# Altium schematic sheet GridSeed_Rev04.SchDoc (part 2 of 2)
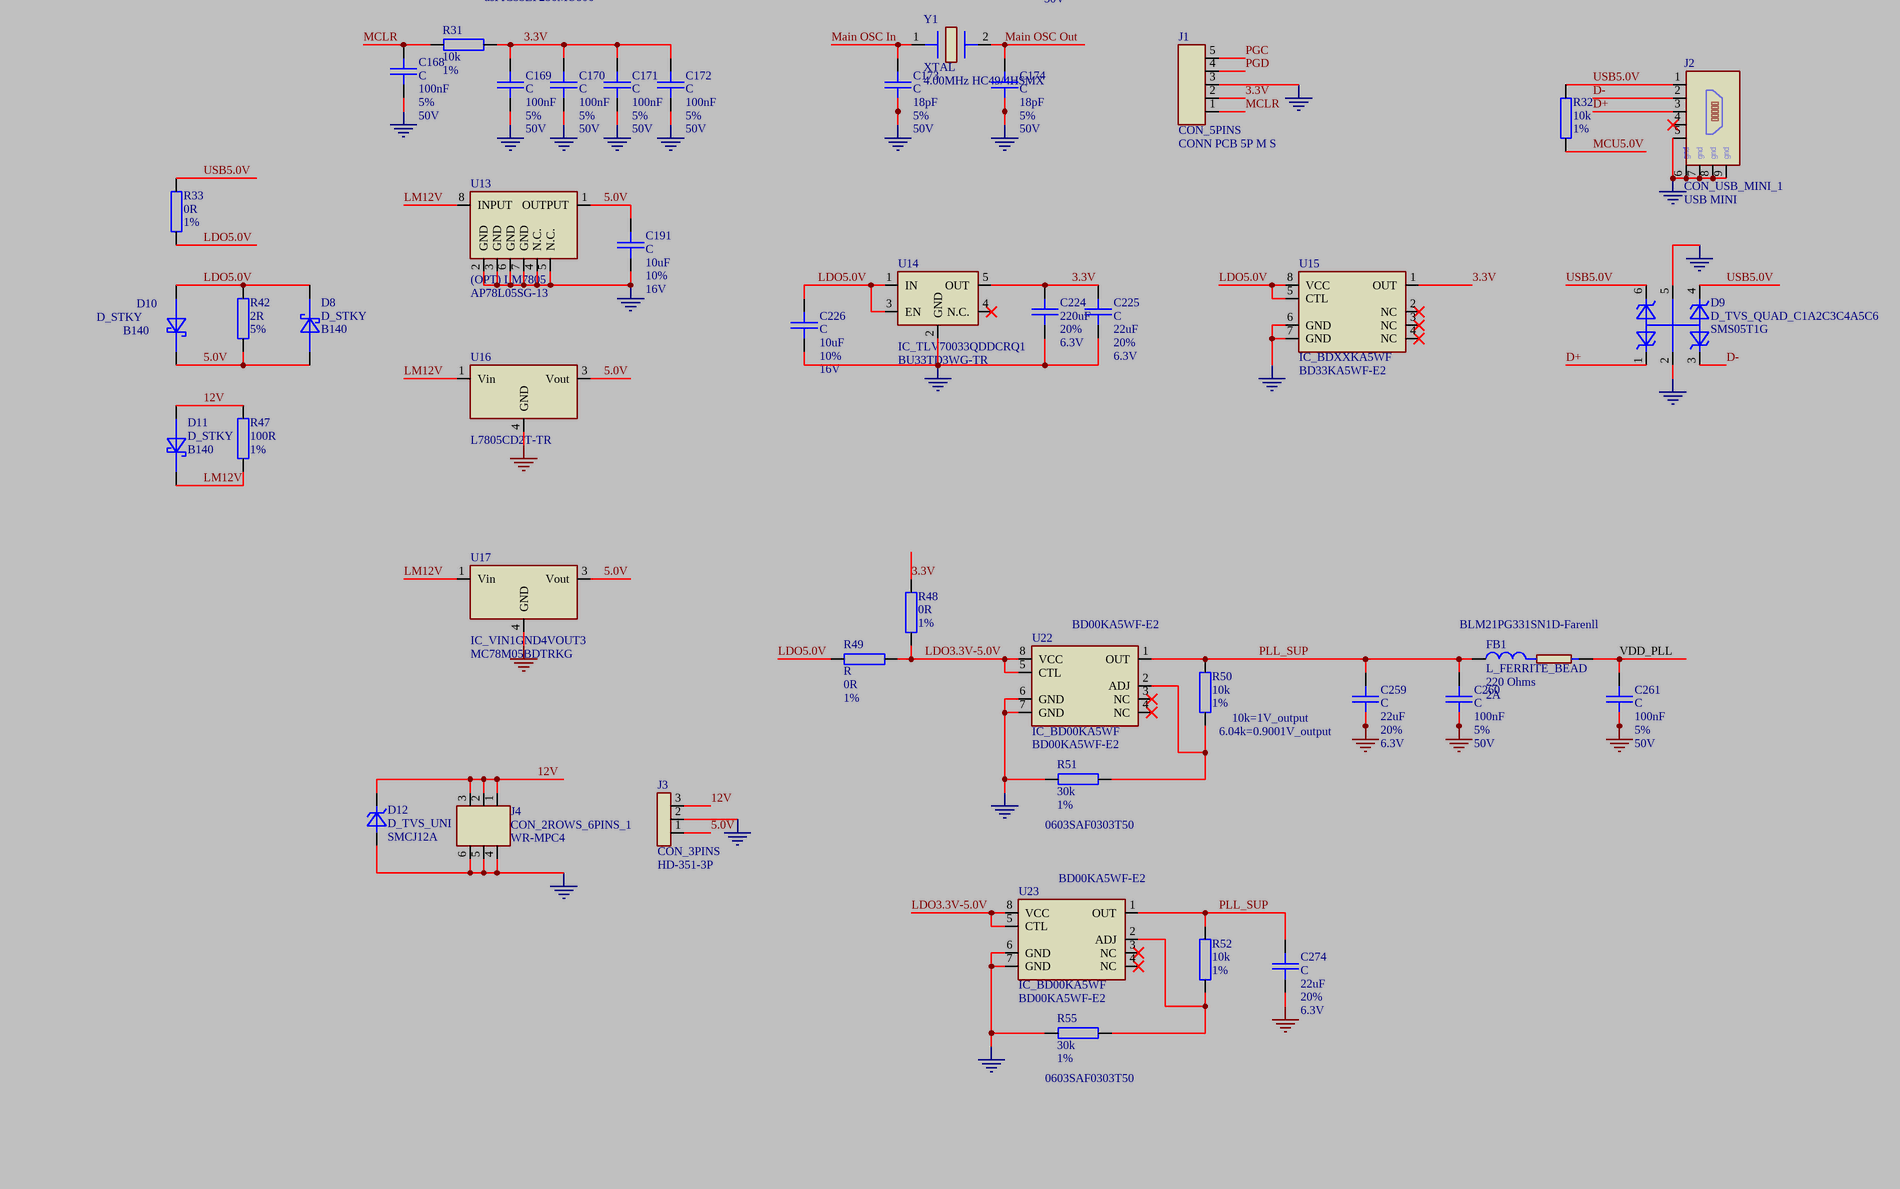
[diagram p6: GridSeed_Rev04.SchDoc, bottom right]

## Nets
GND: C1.1 C2.1 C3.1 C4.2 C5.2 C6.2 C10.1 C11.1 C12.1 C13.1 C14.1 C15.1 C16.1 C17.1 C18.1 C19.1 C20.2 C21.2 C22.1 C23.1 C24.1 C25.1 C26.1 C27.1 C28.1 C29.1 C30.1 C31.1 C32.1 C33.1 C34.1 C35.1 C36.1 C37.1 C38.1 C39.1 C40.1 C41.1 C42.1 C43.1 C44.1 C45.1 C46.1 C47.1 C48.1 C49.1 C50.1 C51.1 C52.1 C53.1 C54.1 C55.1 C56.1 C57.1 C58.1 C59.1 C60.1 C61.1 C62.1 C63.1 C64.1 C65.1 C66.1 C67.1 C68.1 C69.2 C70.1 C71.1 C72.1 C73.1 C74.1 C75.1 C76.1 C77.1 C78.1 C79.1 C80.1 C81.1 C82.1 C83.1 C84.1 C85.1 C118.1 C119.1 C120.1 C121.1 C122.1 C123.1 C124.1 C125.1 C126.1 C127.1 C128.1 C129.1 C130.1 C131.1 C132.1 C133.1 C134.1 C135.1 C136.1 C137.1 C138.2 C139.2 C140.1 C141.1 C142.1 C143.1 C144.1 C145.1 C146.1 C147.1 C148.1 C149.1 C150.1 C151.1 C152.1 C153.1 C154.1 C155.1 C156.1 C157.1 C158.1 C159.1 C160.1 C161.1 C162.1 C163.1 C166.2 C167.2 C168.2 C169.2 C170.2 C171.2 C172.2 C173.2 C174.2 C175.1 C176.1 C177.1 C178.1 C179.1 C180.1 C181.1 C182.1 C183.1 C184.1 C185.1 C186.1 C187.1 C188.1 C189.1 C190.1 C191.2 C224.1 C225.2 C226.2 C227.1 C228.1 C229.1 C230.1 C231.1 C232.1 C233.1 C234.1 C235.1 C236.1 C237.1 C238.1 C239.1 C240.1 C241.1 C242.1 C243.1 C244.1 C245.1 C246.1 C247.1 C248.1 C249.1 C250.1 C251.1 C252.1 C253.1 C254.1 C255.1 C256.1 C257.1 C258.1 C259.2 C260.2 C261.2 C262.1 C263.1 C264.1 C265.1 C266.1 C267.1 C268.1 C269.1 C270.1 C271.1 C272.1 C273.1 C274.2 C275.2 C276.1 C277.1 C278.1 C279.1 C280.1 C281.1 C282.1 C283.1 C284.1 C285.1 C286.1 C287.1 C288.1 C289.1 C290.1 C291.1 C324.1 C325.1 C326.1 C327.1 C328.1 C329.1 C330.1 C331.1 C332.1 C333.1 C334.1 C335.1 C336.1 C337.1 C338.1 C339.1 C340.1 C341.1 C342.1 C343.1 C344.1 C345.1 C346.1 C347.1 C348.1 C349.1 C350.1 C351.1 C352.1 C353.1 C354.1 C355.1 C356.1 C357.1 C358.1 C359.1 C360.1 C361.1 C362.1 C363.1 C364.1 C365.1 C366.1 C367.1 C368.1 C369.1 C370.1 C371.1 C372.1 C373.1 C374.1 C375.1 C376.1 C377.1 C378.1 C379.1 C380.1 C381.1 C382.1 C383.1 C_1.2 C_2.2 C_3.2 C_4.2 C_5.2 C_6.2 C_8.2 C_9.2 C_10.2 C_11.2 C_12.2 C_13.2 C_14.2 C_15.2 C_16.2 C_17.2 C_18.2 C_19.2 C_20.2 C_21.2 C_22.2 C_23.2 C_24.2 C_25.2 C_26.2 C_27.2 C_28.2 C_29.2 C_30.2 C_33.2 C_34.2 C_35.2 C_36.2 C_37.2 C_38.2 C_39.2 C_40.2 C_41.2 C_42.2 C_43.2 C_44.2 C_45.2 C_46.2 C_47.2 C_48.2 C_49.2 C_50.2 C_51.2 C_52.2 C_53.2 C_54.2 C_55.2 C_56.2 C_57.2 C_58.2 C_59.2 C_60.2 C_61.2 C_62.2 C_63.2 C_64.2 C_65.2 C_66.2 C_67.2 C_68.2 C_69.2 C_70.2 C_71.2 C_72.2 D4.1(C) D5.1(C) D6.1(C) D7.1(C) D9.2 D9.5 D12.2(A) J1.3 J2.5 J2.6 J2.7 J2.8 J2.9 J3.2 J4.4 J4.5 J4.6 J5.1 J6.1 J7.1 J8.1 J9.1 J10.1 J11.1 J12.1 J13.1 J14.1 J15.1 Q4.1(S) Q4.2(S) Q4.3(S) Q5.1(S) Q5.2(S) Q5.3(S) Q6.1(S) Q6.2(S) Q6.3(S) Q7.1(S) Q7.2(S) Q7.3(S) Q8.1(S) Q8.2(S) Q8.3(S) Q9.1(S) Q9.2(S) Q9.3(S) R1.1 R2.1 R3.1 R4.1 R17.2 R18.1 R19.1 R20.1 R21.2 R22.2 R24.2 R25.1 R30.2 R43.1 R44.1 R45.1 R46.1 R51.2 R55.2 R64.1 R65.1 R66.1 R67.1 U1.4(GND) U1.9(EP) U2.4(GND) U2.9(EP) U3.4(GND) U3.9(EP) U4.7(VSSA_PLL) U4.10(VSS_PLL) U4.15(DVSS) U4.16(CHIP_ID0) U4.17(CHIP_ID1) U4.18(CHIP_ID2) U4.28(DVSS) U4.31(OVSS1) U4.33(DVSS) U4.36(DVSS) U4.40(DVSS) U4.44(DVSS) U4.50(OVSS0) U4.53(DVSS) U4.61(DVSS) U4.64(DVSS) U4.65(DVSS_EP) U5.7(VSSA_PLL) U5.10(VSS_PLL) U5.15(DVSS) U5.17(CHIP_ID1) U5.18(CHIP_ID2) U5.28(DVSS) U5.31(OVSS1) U5.33(DVSS) U5.36(DVSS) U5.40(DVSS) U5.44(DVSS) U5.50(OVSS0) U5.53(DVSS) U5.61(DVSS) U5.64(DVSS) U5.65(DVSS_EP) U6.7(VSSA_PLL) U6.10(VSS_PLL) U6.15(DVSS) U6.16(CHIP_ID0) U6.18(CHIP_ID2) U6.28(DVSS) U6.31(OVSS1) U6.33(DVSS) U6.36(DVSS) U6.40(DVSS) U6.44(DVSS) U6.50(OVSS0) U6.53(DVSS) U6.61(DVSS) U6.64(DVSS) U6.65(DVSS_EP) U7.7(VSSA_PLL) U7.10(VSS_PLL) U7.15(DVSS) U7.18(CHIP_ID2) U7.28(DVSS) U7.31(OVSS1) U7.33(DVSS) U7.36(DVSS) U7.40(DVSS) U7.44(DVSS) U7.50(OVSS0) U7.53(DVSS) U7.61(DVSS) U7.64(DVSS) U7.65(DVSS_EP) U8.9(VSS) U8.20(AVSS) U8.25(VSS) U8.41(VSS) U9.7(VSSA_PLL) U9.10(VSS_PLL) U9.15(DVSS) U9.16(CHIP_ID0) U9.17(CHIP_ID1) U9.28(DVSS) U9.31(OVSS1) U9.33(DVSS) U9.36(DVSS) U9.40(DVSS) U9.44(DVSS) U9.50(OVSS0) U9.53(DVSS) U9.61(DVSS) U9.64(DVSS) U9.65(DVSS_EP) U10.7(VSSA_PLL) U10.10(VSS_PLL) U10.15(DVSS) U10.17(CHIP_ID1) U10.28(DVSS) U10.31(OVSS1) U10.33(DVSS) U10.36(DVSS) U10.40(DVSS) U10.44(DVSS) U10.50(OVSS0) U10.53(DVSS) U10.61(DVSS) U10.64(DVSS) U10.65(DVSS_EP) U11.7(VSSA_PLL) U11.10(VSS_PLL) U11.15(DVSS) U11.16(CHIP_ID0) U11.28(DVSS) U11.31(OVSS1) U11.33(DVSS) U11.36(DVSS) U11.40(DVSS) U11.44(DVSS) U11.50(OVSS0) U11.53(DVSS) U11.61(DVSS) U11.64(DVSS) U11.65(DVSS_EP) U12.7(VSSA_PLL) U12.10(VSS_PLL) U12.15(DVSS) U12.28(DVSS) U12.31(OVSS1) U12.33(DVSS) U12.36(DVSS) U12.40(DVSS) U12.44(DVSS) U12.50(OVSS0) U12.53(DVSS) U12.61(DVSS) U12.64(DVSS) U12.65(DVSS_EP) U13.2(GND) U13.3(GND) U13.4(N.C.) U13.5(N.C.) U13.6(GND) U13.7(GND) U14.2(GND) U15.6(GND) U15.7(GND) U16.4(GND) U17.4(GND) U18.7(VSSA_PLL) U18.10(VSS_PLL) U18.15(DVSS) U18.16(CHIP_ID0) U18.17(CHIP_ID1) U18.18(CHIP_ID2) U18.28(DVSS) U18.31(OVSS1) U18.33(DVSS) U18.36(DVSS) U18.40(DVSS) U18.44(DVSS) U18.50(OVSS0) U18.53(DVSS) U18.61(DVSS) U18.64(DVSS) U18.65(DVSS_EP) U19.7(VSSA_PLL) U19.10(VSS_PLL) U19.15(DVSS) U19.17(CHIP_ID1) U19.18(CHIP_ID2) U19.28(DVSS) U19.31(OVSS1) U19.33(DVSS) U19.36(DVSS) U19.40(DVSS) U19.44(DVSS) U19.50(OVSS0) U19.53(DVSS) U19.61(DVSS) U19.64(DVSS) U19.65(DVSS_EP) U20.7(VSSA_PLL) U20.10(VSS_PLL) U20.15(DVSS) U20.16(CHIP_ID0) U20.18(CHIP_ID2) U20.28(DVSS) U20.31(OVSS1) U20.33(DVSS) U20.36(DVSS) U20.40(DVSS) U20.44(DVSS) U20.50(OVSS0) U20.53(DVSS) U20.61(DVSS) U20.64(DVSS) U20.65(DVSS_EP) U21.7(VSSA_PLL) U21.10(VSS_PLL) U21.15(DVSS) U21.16(CHIP_ID0) U21.28(DVSS) U21.31(OVSS1) U21.33(DVSS) U21.36(DVSS) U21.40(DVSS) U21.44(DVSS) U21.50(OVSS0) U21.53(DVSS) U21.61(DVSS) U21.64(DVSS) U21.65(DVSS_EP) U22.6(GND) U22.7(GND) U23.6(GND) U23.7(GND) U24.7(VSSA_PLL) U24.10(VSS_PLL) U24.15(DVSS) U24.16(CHIP_ID0) U24.17(CHIP_ID1) U24.28(DVSS) U24.31(OVSS1) U24.33(DVSS) U24.36(DVSS) U24.40(DVSS) U24.44(DVSS) U24.50(OVSS0) U24.53(DVSS) U24.61(DVSS) U24.64(DVSS) U24.65(DVSS_EP) U25.7(VSSA_PLL) U25.10(VSS_PLL) U25.15(DVSS) U25.17(CHIP_ID1) U25.28(DVSS) U25.31(OVSS1) U25.33(DVSS) U25.36(DVSS) U25.40(DVSS) U25.44(DVSS) U25.50(OVSS0) U25.53(DVSS) U25.61(DVSS) U25.64(DVSS) U25.65(DVSS_EP) U26.7(VSSA_PLL) U26.10(VSS_PLL) U26.15(DVSS) U26.16(CHIP_ID0) U26.28(DVSS) U26.31(OVSS1) U26.33(DVSS) U26.36(DVSS) U26.40(DVSS) U26.44(DVSS) U26.50(OVSS0) U26.53(DVSS) U26.61(DVSS) U26.64(DVSS) U26.65(DVSS_EP) U27.7(VSSA_PLL) U27.10(VSS_PLL) U27.15(DVSS) U27.28(DVSS) U27.31(OVSS1) U27.33(DVSS) U27.36(DVSS) U27.40(DVSS) U27.44(DVSS) U27.50(OVSS0) U27.53(DVSS) U27.61(DVSS) U27.64(DVSS) U27.65(DVSS_EP)
1V: C12.2 C13.2 C14.2 C17.2 C18.2 C19.2 C22.2 C23.2 C24.2 C25.2 C26.2 C28.2 C30.2 C31.2 C33.2 C35.2 C36.2 C38.2 C40.2 C41.2 C43.2 C45.2 C46.2 C47.2 C48.2 C49.2 C50.2 C51.2 C52.2 C53.2 C54.2 C55.2 C56.2 C57.2 C58.2 C59.2 C60.2 C61.2 C62.2 C63.2 C64.2 C65.2 C66.2 C67.2 C68.2 C70.2 C71.2 C72.2 C74.2 C75.2 C76.2 C78.2 C79.2 C80.2 C82.2 C83.2 C84.2 C118.2 C119.2 C121.2 C123.2 C124.2 C126.2 C128.2 C129.2 C131.2 C133.2 C134.2 C136.2 C140.2 C141.2 C142.2 C143.2 C144.2 C145.2 C146.2 C147.2 C148.2 C149.2 C150.2 C151.2 C152.2 C153.2 C154.2 C155.2 C156.2 C157.2 C158.2 C159.2 C160.2 C161.2 C162.2 C163.2 C175.2 C176.2 C177.2 C179.2 C180.2 C181.2 C183.2 C184.2 C185.2 C187.2 C188.2 C189.2 C227.2 C228.2 C230.2 C232.2 C233.2 C235.2 C237.2 C238.2 C240.2 C242.2 C243.2 C245.2 C247.2 C248.2 C249.2 C250.2 C251.2 C252.2 C253.2 C254.2 C255.2 C256.2 C257.2 C258.2 C262.2 C263.2 C264.2 C265.2 C266.2 C267.2 C268.2 C269.2 C270.2 C271.2 C272.2 C273.2 C276.2 C277.2 C278.2 C280.2 C281.2 C282.2 C284.2 C285.2 C286.2 C288.2 C289.2 C290.2 C324.2 C325.2 C327.2 C329.2 C330.2 C332.2 C334.2 C335.2 C337.2 C339.2 C340.2 C342.2 C344.2 C345.2 C346.2 C347.2 C348.2 C349.2 C350.2 C351.2 C352.2 C353.2 C354.2 C355.2 C356.2 C357.2 C358.2 C359.2 C360.2 C361.2 C362.2 C363.2 C364.2 C365.2 C366.2 C367.2 C368.2 C369.2 C370.2 C372.2 C373.2 C374.2 C376.2 C377.2 C378.2 C380.2 C381.2 C382.2 C_1.1 C_2.1 C_3.1 C_4.1 C_5.1 C_6.1 C_8.1 C_9.1 C_10.1 C_11.1 C_12.1 C_13.1 C_14.1 C_15.1 C_16.1 C_17.1 C_18.1 C_19.1 C_20.1 C_21.1 C_22.1 C_23.1 C_24.1 C_25.1 C_26.1 C_27.1 C_28.1 C_29.1 C_30.1 C_33.1 C_34.1 C_35.1 C_36.1 C_37.1 C_38.1 C_39.1 C_40.1 C_41.1 C_42.1 C_43.1 C_44.1 C_45.1 C_46.1 C_47.1 C_48.1 C_49.1 C_50.1 C_51.1 C_52.1 C_53.1 C_54.1 C_55.1 C_56.1 C_57.1 C_58.1 C_59.1 C_60.1 C_61.1 C_62.1 C_63.1 C_64.1 C_65.1 C_66.1 C_67.1 C_68.1 C_69.1 C_70.1 C_71.1 C_72.1 L1.2 L2.2 L3.2 R26.2 U4.3(DVDD) U4.4(DVDD) U4.5(DVDD) U4.6(DVDD) U4.13(DVDD) U4.14(DVDD) U4.19(DVDD) U4.20(DVDD) U4.21(DVDD) U4.22(DVDD) U4.26(DVDD) U4.27(DVDD) U4.29(DVDD) U4.30(DVDD) U4.34(DVDD) U4.35(DVDD) U4.37(DVDD) U4.38(DVDD) U4.39(DVDD) U4.41(DVDD) U4.42(DVDD) U4.43(DVDD) U4.45(DVDD) U4.46(DVDD) U4.51(DVDD) U4.52(DVDD) U4.54(DVDD) U4.55(DVDD) U4.58(DVDD) U4.59(DVDD) U4.60(DVDD) U4.62(DVDD) U4.63(DVDD) U5.3(DVDD) U5.4(DVDD) U5.5(DVDD) U5.6(DVDD) U5.13(DVDD) U5.14(DVDD) U5.19(DVDD) U5.20(DVDD) U5.21(DVDD) U5.22(DVDD) U5.26(DVDD) U5.27(DVDD) U5.29(DVDD) U5.30(DVDD) U5.34(DVDD) U5.35(DVDD) U5.37(DVDD) U5.38(DVDD) U5.39(DVDD) U5.41(DVDD) U5.42(DVDD) U5.43(DVDD) U5.45(DVDD) U5.46(DVDD) U5.51(DVDD) U5.52(DVDD) U5.54(DVDD) U5.55(DVDD) U5.58(DVDD) U5.59(DVDD) U5.60(DVDD) U5.62(DVDD) U5.63(DVDD) U6.3(DVDD) U6.4(DVDD) U6.5(DVDD) U6.6(DVDD) U6.13(DVDD) U6.14(DVDD) U6.19(DVDD) U6.20(DVDD) U6.21(DVDD) U6.22(DVDD) U6.26(DVDD) U6.27(DVDD) U6.29(DVDD) U6.30(DVDD) U6.34(DVDD) U6.35(DVDD) U6.37(DVDD) U6.38(DVDD) U6.39(DVDD) U6.41(DVDD) U6.42(DVDD) U6.43(DVDD) U6.45(DVDD) U6.46(DVDD) U6.51(DVDD) U6.52(DVDD) U6.54(DVDD) U6.55(DVDD) U6.58(DVDD) U6.59(DVDD) U6.60(DVDD) U6.62(DVDD) U6.63(DVDD) U7.3(DVDD) U7.4(DVDD) U7.5(DVDD) U7.6(DVDD) U7.13(DVDD) U7.14(DVDD) U7.19(DVDD) U7.20(DVDD) U7.21(DVDD) U7.22(DVDD) U7.26(DVDD) U7.27(DVDD) U7.29(DVDD) U7.30(DVDD) U7.34(DVDD) U7.35(DVDD) U7.37(DVDD) U7.38(DVDD) U7.39(DVDD) U7.41(DVDD) U7.42(DVDD) U7.43(DVDD) U7.45(DVDD) U7.46(DVDD) U7.51(DVDD) U7.52(DVDD) U7.54(DVDD) U7.55(DVDD) U7.58(DVDD) U7.59(DVDD) U7.60(DVDD) U7.62(DVDD) U7.63(DVDD) U9.3(DVDD) U9.4(DVDD) U9.5(DVDD) U9.6(DVDD) U9.13(DVDD) U9.14(DVDD) U9.19(DVDD) U9.20(DVDD) U9.21(DVDD) U9.22(DVDD) U9.26(DVDD) U9.27(DVDD) U9.29(DVDD) U9.30(DVDD) U9.34(DVDD) U9.35(DVDD) U9.37(DVDD) U9.38(DVDD) U9.39(DVDD) U9.41(DVDD) U9.42(DVDD) U9.43(DVDD) U9.45(DVDD) U9.46(DVDD) U9.51(DVDD) U9.52(DVDD) U9.54(DVDD) U9.55(DVDD) U9.58(DVDD) U9.59(DVDD) U9.60(DVDD) U9.62(DVDD) U9.63(DVDD) U10.3(DVDD) U10.4(DVDD) U10.5(DVDD) U10.6(DVDD) U10.13(DVDD) U10.14(DVDD) U10.19(DVDD) U10.20(DVDD) U10.21(DVDD) U10.22(DVDD) U10.26(DVDD) U10.27(DVDD) U10.29(DVDD) U10.30(DVDD) U10.34(DVDD) U10.35(DVDD) U10.37(DVDD) U10.38(DVDD) U10.39(DVDD) U10.41(DVDD) U10.42(DVDD) U10.43(DVDD) U10.45(DVDD) U10.46(DVDD) U10.51(DVDD) U10.52(DVDD) U10.54(DVDD) U10.55(DVDD) U10.58(DVDD) U10.59(DVDD) U10.60(DVDD) U10.62(DVDD) U10.63(DVDD) U11.3(DVDD) U11.4(DVDD) U11.5(DVDD) U11.6(DVDD) U11.13(DVDD) U11.14(DVDD) U11.19(DVDD) U11.20(DVDD) U11.21(DVDD) U11.22(DVDD) U11.26(DVDD) U11.27(DVDD) U11.29(DVDD) U11.30(DVDD) U11.34(DVDD) U11.35(DVDD) U11.37(DVDD) U11.38(DVDD) U11.39(DVDD) U11.41(DVDD) U11.42(DVDD) U11.43(DVDD) U11.45(DVDD) U11.46(DVDD) U11.51(DVDD) U11.52(DVDD) U11.54(DVDD) U11.55(DVDD) U11.58(DVDD) U11.59(DVDD) U11.60(DVDD) U11.62(DVDD) U11.63(DVDD) U12.3(DVDD) U12.4(DVDD) U12.5(DVDD) U12.6(DVDD) U12.13(DVDD) U12.14(DVDD) U12.19(DVDD) U12.20(DVDD) U12.21(DVDD) U12.22(DVDD) U12.26(DVDD) U12.27(DVDD) U12.29(DVDD) U12.30(DVDD) U12.34(DVDD) U12.35(DVDD) U12.37(DVDD) U12.38(DVDD) U12.39(DVDD) U12.41(DVDD) U12.42(DVDD) U12.43(DVDD) U12.45(DVDD) U12.46(DVDD) U12.51(DVDD) U12.52(DVDD) U12.54(DVDD) U12.55(DVDD) U12.58(DVDD) U12.59(DVDD) U12.60(DVDD) U12.62(DVDD) U12.63(DVDD) U18.3(DVDD) U18.4(DVDD) U18.5(DVDD) U18.6(DVDD) U18.13(DVDD) U18.14(DVDD) U18.19(DVDD) U18.20(DVDD) U18.21(DVDD) U18.22(DVDD) U18.26(DVDD) U18.27(DVDD) U18.29(DVDD) U18.30(DVDD) U18.34(DVDD) U18.35(DVDD) U18.37(DVDD) U18.38(DVDD) U18.39(DVDD) U18.41(DVDD) U18.42(DVDD) U18.43(DVDD) U18.45(DVDD) U18.46(DVDD) U18.51(DVDD) U18.52(DVDD) U18.54(DVDD) U18.55(DVDD) U18.58(DVDD) U18.59(DVDD) U18.60(DVDD) U18.62(DVDD) U18.63(DVDD) U19.3(DVDD) U19.4(DVDD) U19.5(DVDD) U19.6(DVDD) U19.13(DVDD) U19.14(DVDD) U19.19(DVDD) U19.20(DVDD) U19.21(DVDD) U19.22(DVDD) U19.26(DVDD) U19.27(DVDD) U19.29(DVDD) U19.30(DVDD) U19.34(DVDD) U19.35(DVDD) U19.37(DVDD) U19.38(DVDD) U19.39(DVDD) U19.41(DVDD) U19.42(DVDD) U19.43(DVDD) U19.45(DVDD) U19.46(DVDD) U19.51(DVDD) U19.52(DVDD) U19.54(DVDD) U19.55(DVDD) U19.58(DVDD) U19.59(DVDD) U19.60(DVDD) U19.62(DVDD) U19.63(DVDD) U20.3(DVDD) U20.4(DVDD) U20.5(DVDD) U20.6(DVDD) U20.13(DVDD) U20.14(DVDD) U20.19(DVDD) U20.20(DVDD) U20.21(DVDD) U20.22(DVDD) U20.26(DVDD) U20.27(DVDD) U20.29(DVDD) U20.30(DVDD) U20.34(DVDD) U20.35(DVDD) U20.37(DVDD) U20.38(DVDD) U20.39(DVDD) U20.41(DVDD) U20.42(DVDD) U20.43(DVDD) U20.45(DVDD) U20.46(DVDD) U20.51(DVDD) U20.52(DVDD) U20.54(DVDD) U20.55(DVDD) U20.58(DVDD) U20.59(DVDD) U20.60(DVDD) U20.62(DVDD) U20.63(DVDD) U21.3(DVDD) U21.4(DVDD) U21.5(DVDD) U21.6(DVDD) U21.13(DVDD) U21.14(DVDD) U21.19(DVDD) U21.20(DVDD) U21.21(DVDD) U21.22(DVDD) U21.26(DVDD) U21.27(DVDD) U21.29(DVDD) U21.30(DVDD) U21.34(DVDD) U21.35(DVDD) U21.37(DVDD) U21.38(DVDD) U21.39(DVDD) U21.41(DVDD) U21.42(DVDD) U21.43(DVDD) U21.45(DVDD) U21.46(DVDD) U21.51(DVDD) U21.52(DVDD) U21.54(DVDD) U21.55(DVDD) U21.58(DVDD) U21.59(DVDD) U21.60(DVDD) U21.62(DVDD) U21.63(DVDD) U24.3(DVDD) U24.4(DVDD) U24.5(DVDD) U24.6(DVDD) U24.13(DVDD) U24.14(DVDD) U24.19(DVDD) U24.20(DVDD) U24.21(DVDD) U24.22(DVDD) U24.26(DVDD) U24.27(DVDD) U24.29(DVDD) U24.30(DVDD) U24.34(DVDD) U24.35(DVDD) U24.37(DVDD) U24.38(DVDD) U24.39(DVDD) U24.41(DVDD) U24.42(DVDD) U24.43(DVDD) U24.45(DVDD) U24.46(DVDD) U24.51(DVDD) U24.52(DVDD) U24.54(DVDD) U24.55(DVDD) U24.58(DVDD) U24.59(DVDD) U24.60(DVDD) U24.62(DVDD) U24.63(DVDD) U25.3(DVDD) U25.4(DVDD) U25.5(DVDD) U25.6(DVDD) U25.13(DVDD) U25.14(DVDD) U25.19(DVDD) U25.20(DVDD) U25.21(DVDD) U25.22(DVDD) U25.26(DVDD) U25.27(DVDD) U25.29(DVDD) U25.30(DVDD) U25.34(DVDD) U25.35(DVDD) U25.37(DVDD) U25.38(DVDD) U25.39(DVDD) U25.41(DVDD) U25.42(DVDD) U25.43(DVDD) U25.45(DVDD) U25.46(DVDD) U25.51(DVDD) U25.52(DVDD) U25.54(DVDD) U25.55(DVDD) U25.58(DVDD) U25.59(DVDD) U25.60(DVDD) U25.62(DVDD) U25.63(DVDD) U26.3(DVDD) U26.4(DVDD) U26.5(DVDD) U26.6(DVDD) U26.13(DVDD) U26.14(DVDD) U26.19(DVDD) U26.20(DVDD) U26.21(DVDD) U26.22(DVDD) U26.26(DVDD) U26.27(DVDD) U26.29(DVDD) U26.30(DVDD) U26.34(DVDD) U26.35(DVDD) U26.37(DVDD) U26.38(DVDD) U26.39(DVDD) U26.41(DVDD) U26.42(DVDD) U26.43(DVDD) U26.45(DVDD) U26.46(DVDD) U26.51(DVDD) U26.52(DVDD) U26.54(DVDD) U26.55(DVDD) U26.58(DVDD) U26.59(DVDD) U26.60(DVDD) U26.62(DVDD) U26.63(DVDD) U27.3(DVDD) U27.4(DVDD) U27.5(DVDD) U27.6(DVDD) U27.13(DVDD) U27.14(DVDD) U27.19(DVDD) U27.20(DVDD) U27.21(DVDD) U27.22(DVDD) U27.26(DVDD) U27.27(DVDD) U27.29(DVDD) U27.30(DVDD) U27.34(DVDD) U27.35(DVDD) U27.37(DVDD) U27.38(DVDD) U27.39(DVDD) U27.41(DVDD) U27.42(DVDD) U27.43(DVDD) U27.45(DVDD) U27.46(DVDD) U27.51(DVDD) U27.52(DVDD) U27.54(DVDD) U27.55(DVDD) U27.58(DVDD) U27.59(DVDD) U27.60(DVDD) U27.62(DVDD) U27.63(DVDD)
3.3V: C29.2 C34.2 C39.2 C44.2 C69.1 C73.2 C77.2 C81.2 C85.2 C122.2 C127.2 C132.2 C137.2 C167.1 C169.1 C170.1 C171.1 C172.1 C178.2 C182.2 C186.2 C190.2 C224.2 C225.1 C231.2 C236.2 C241.2 C246.2 C275.1 C279.2 C283.2 C287.2 C291.2 C328.2 C333.2 C338.2 C343.2 C371.2 C375.2 C379.2 C383.2 J1.2 R5.2 R6.2 R7.2 R8.1 R31.2 R48.2 R53.2 R54.1 U4.32(OVDD1) U4.49(OVDD0) U5.16(CHIP_ID0) U5.32(OVDD1) U5.49(OVDD0) U6.17(CHIP_ID1) U6.32(OVDD1) U6.49(OVDD0) U7.16(CHIP_ID0) U7.17(CHIP_ID1) U7.32(OVDD1) U7.49(OVDD0) U8.10(VDD) U8.19(AVDD) U8.26(VDD) U8.35(VUSB3V3) U8.38(VDD) U8.57(VDD) U9.18(CHIP_ID2) U9.32(OVDD1) U9.49(OVDD0) U10.16(CHIP_ID0) U10.18(CHIP_ID2) U10.32(OVDD1) U10.49(OVDD0) U11.17(CHIP_ID1) U11.18(CHIP_ID2) U11.32(OVDD1) U11.49(OVDD0) U12.16(CHIP_ID0) U12.17(CHIP_ID1) U12.18(CHIP_ID2) U12.32(OVDD1) U12.49(OVDD0) U14.5(OUT) U15.1(OUT) U18.32(OVDD1) U18.49(OVDD0) U19.16(CHIP_ID0) U19.32(OVDD1) U19.49(OVDD0) U20.17(CHIP_ID1) U20.32(OVDD1) U20.49(OVDD0) U21.17(CHIP_ID1) U21.18(CHIP_ID2) U21.32(OVDD1) U21.49(OVDD0) U24.18(CHIP_ID2) U24.32(OVDD1) U24.49(OVDD0) U25.16(CHIP_ID0) U25.18(CHIP_ID2) U25.32(OVDD1) U25.49(OVDD0) U26.17(CHIP_ID1) U26.18(CHIP_ID2) U26.32(OVDD1) U26.49(OVDD0) U27.16(CHIP_ID0) U27.17(CHIP_ID1) U27.18(CHIP_ID2) U27.32(OVDD1) U27.49(OVDD0)
5.0V: C1.2 C2.2 C3.2 C191.1 D1.1(A1) D1.2(A2) D2.1(A1) D2.2(A2) D3.1(A1) D3.2(A2) D8.2(A) D10.1(C) J3.1 R42.1 U1.7(VCC) U2.7(VCC) U3.7(VCC) U13.1(OUTPUT) U16.3(Vout) U17.3(Vout)
12V: C10.2 C11.2 C15.2 C16.2 C20.1 C21.1 D11.2(A) D12.1(C) J3.3 J4.1 J4.2 J4.3 Q1.5(D) Q1.6(D) Q1.7(D) Q1.8(D) Q2.5(D) Q2.6(D) Q2.7(D) Q2.8(D) Q3.5(D) Q3.6(D) Q3.7(D) Q3.8(D) R23.1 R47.2
ASIC_RESET_MCU: C27.2 C32.2 C37.2 C42.2 C120.2 C125.2 C130.2 C135.2 C229.2 C234.2 C239.2 C244.2 C326.2 C331.2 C336.2 C341.2 R5.1 U4.57(RSTN) U5.57(RSTN) U6.57(RSTN) U7.57(RSTN) U8.5(C1IN1-/SDI2/PMA4/RPI119/RG7) U9.57(RSTN) U10.57(RSTN) U11.57(RSTN) U12.57(RSTN) U18.57(RSTN) U19.57(RSTN) U20.57(RSTN) U21.57(RSTN) U24.57(RSTN) U25.57(RSTN) U26.57(RSTN) U27.57(RSTN)
BOOT1: C7.1 D1.3(CC) U1.8(BOOST)
BOOT2: C8.1 D2.3(CC) U2.8(BOOST)
BOOT3: C9.1 D3.3(CC) U3.8(BOOST)
CORE_CLKOUT_1: R1.2 U4.56(CORE_CLKOUT)
CORE_CLKOUT_2: R2.2 U5.56(CORE_CLKOUT)
CORE_CLKOUT_3: R3.2 U6.56(CORE_CLKOUT)
CORE_CLKOUT_4: R4.2 U7.56(CORE_CLKOUT)
CORE_CLKOUT_5: R17.1 U9.56(CORE_CLKOUT)
CORE_CLKOUT_6: R18.2 U10.56(CORE_CLKOUT)
CORE_CLKOUT_7: R19.2 U11.56(CORE_CLKOUT)
CORE_CLKOUT_8: R20.2 U12.56(CORE_CLKOUT)
CORE_CLKOUT_9: R43.2 U18.56(CORE_CLKOUT)
CORE_CLKOUT_10: R44.2 U19.56(CORE_CLKOUT)
CORE_CLKOUT_11: R45.2 U20.56(CORE_CLKOUT)
CORE_CLKOUT_12: R46.2 U21.56(CORE_CLKOUT)
CORE_CLKOUT_13: R64.2 U24.56(CORE_CLKOUT)
CORE_CLKOUT_14: R65.2 U25.56(CORE_CLKOUT)
CORE_CLKOUT_15: R66.2 U26.56(CORE_CLKOUT)
CORE_CLKOUT_16: R67.2 U27.56(CORE_CLKOUT)
D+: D9.1 J2.3 U8.37(D+/RG2)
D-: D9.3 J2.2 U8.36(D-/RG3)
DRVLogic: C4.1 C5.1 C6.1 U1.6(VLOGIC) U2.6(VLOGIC) U3.6(VLOGIC) U8.55(C3IN1+/VCMPST3/RP71/RD7)
FB: C166.1 R26.1 U8.17(PGEC1/AN6/RPI38/RB6)
GREEN: D5.2(A) U8.47(PGED2/SOSCI/C3IN3-/RPI61/RC13)
HO1: Q2.4(G) U1.1(TG)
HO2: Q3.4(G) U2.1(TG)
HO3: Q1.4(G) U3.1(TG)
LDO3.3V-5.0V: R48.1 R49.1 U22.5(CTL) U22.8(VCC) U23.5(CTL) U23.8(VCC)
LDO5.0V: C226.1 D8.1(C) D10.2(A) R33.1 R42.2 R49.2 U14.1(IN) U14.3(EN) U15.5(CTL) U15.8(VCC)
LM12V: D11.1(C) R47.1 U13.8(INPUT) U16.1(Vin) U17.1(Vin)
LO1: Q6.4(G) Q7.4(G) U1.3(BG)
LO2: Q8.4(G) Q9.4(G) U2.3(BG)
LO3: Q4.4(G) Q5.4(G) U3.3(BG)
LTC_EN: R6.1 U4.47(LTC_EN) U5.47(LTC_EN) U6.47(LTC_EN) U7.47(LTC_EN) U8.23(TMS/AN10/CVREF/PMA13/RPI42/RB10) U9.47(LTC_EN) U10.47(LTC_EN) U11.47(LTC_EN) U12.47(LTC_EN) U18.47(LTC_EN) U19.47(LTC_EN) U20.47(LTC_EN) U21.47(LTC_EN) U24.47(LTC_EN) U25.47(LTC_EN) U26.47(LTC_EN) U27.47(LTC_EN)
Main OSC In: C173.1 U8.39(OSC1/RPI60/RC12) Y1.1
Main OSC Out: C174.1 U8.40(OSC2/CLKO/RC15) Y1.2
MCLR: C168.1 J1.1 R31.1 U8.7(~{MCLR})
MCU5.0V: R32.2 U8.34(VBUS)
MEAS12: C138.1 R23.2 R25.2 U8.18(PGED1/AN7/RCV/RPI39/RB7)
ORANGE: D7.2(A) U8.45(PMCS1/RPI75/RD11)
PGC: J1.5 U8.15(PGEC3/AN1/VREF-/RPI33/RB1)
PGD: J1.4 U8.16(PGED3/AN0/VREF+/RPI32/RB0)
PLL_SUP: C259.1 C260.1 C274.1 FB1.1 R50.1 R52.1 U22.1(OUT) U23.1(OUT)
PWM2H: R22.1 U2.5(IN) U8.63(AN27/PWM2H/PMD3/RPI83/RE3)
PWM2L: R24.1 U1.5(IN) U8.62(AN26/PWM2L/PMD2/RP82/RE2)
PWM3L: R21.1 U3.5(IN) U8.64(AN28/PWM3L/PMD4/RP84/RE4)
RED: D4.2(A) U8.48(PGEC2/SOSCO/C3IN1-/T1CK/RPI62/RC14)
RX_BTC_0: U4.1(CFG_P) U5.1(CFG_P) U6.1(CFG_P) U7.1(CFG_P) U8.59(VCMPST2/RP97/RF1) U9.1(CFG_P) U10.1(CFG_P) U11.1(CFG_P) U12.1(CFG_P)
RX_BTC_1: U8.3(AN31/PWM4H/PMD7/RP87/RE7) U18.1(CFG_P) U19.1(CFG_P) U20.1(CFG_P) U21.1(CFG_P) U24.1(CFG_P) U25.1(CFG_P) U26.1(CFG_P) U27.1(CFG_P)
RX_LTC_0: U4.2(CFG_N) U5.2(CFG_N) U6.2(CFG_N) U7.2(CFG_N) U8.58(VCMPST1/RP96/RF0) U9.2(CFG_N) U10.2(CFG_N) U11.2(CFG_N) U12.2(CFG_N)
RX_LTC_1: U8.4(C1IN3-/SCK2/PMA5/RP118/RG6) U18.2(CFG_N) U19.2(CFG_N) U20.2(CFG_N) U21.2(CFG_N) U24.2(CFG_N) U25.2(CFG_N) U26.2(CFG_N) U27.2(CFG_N)
SWN1: C7.2 L1.1 Q2.1(S) Q2.2(S) Q2.3(S) Q6.5(D) Q6.6(D) Q6.7(D) Q6.8(D) Q7.5(D) Q7.6(D) Q7.7(D) Q7.8(D) U1.2(TS)
SWN2: C8.2 L2.1 Q3.1(S) Q3.2(S) Q3.3(S) Q8.5(D) Q8.6(D) Q8.7(D) Q8.8(D) Q9.5(D) Q9.6(D) Q9.7(D) Q9.8(D) U2.2(TS)
SWN3: C9.2 L3.1 Q1.1(S) Q1.2(S) Q1.3(S) Q4.5(D) Q4.6(D) Q4.7(D) Q4.8(D) Q5.5(D) Q5.6(D) Q5.7(D) Q5.8(D) U3.2(TS)
TP1011: TP5.1 U4.25(RPT_BUSYN)
TP1012: TP6.1 U5.25(RPT_BUSYN)
TP1013: TP7.1 U6.25(RPT_BUSYN)
TP1014: TP8.1 U7.25(RPT_BUSYN)
TP1015: TP32.1 U9.25(RPT_BUSYN)
TP1016: TP33.1 U10.25(RPT_BUSYN)
TP1017: TP34.1 U11.25(RPT_BUSYN)
TP1018: TP35.1 U12.25(RPT_BUSYN)
TP1019: TP40.1 U18.25(RPT_BUSYN)
TP10110: TP41.1 U19.25(RPT_BUSYN)
TP10111: TP42.1 U20.25(RPT_BUSYN)
TP10112: TP43.1 U21.25(RPT_BUSYN)
TP10113: TP49.1 U24.25(RPT_BUSYN)
TP10114: TP50.1 U25.25(RPT_BUSYN)
TP10115: TP51.1 U26.25(RPT_BUSYN)
TP10116: TP52.1 U27.25(RPT_BUSYN)
TP_1001: TP1.1 U4.48(LTC_BUSYN)
TP_1002: TP2.1 U5.48(LTC_BUSYN)
TP_1003: TP3.1 U6.48(LTC_BUSYN)
TP_1004: TP4.1 U7.48(LTC_BUSYN)
TP_1005: TP13.1 U9.48(LTC_BUSYN)
TP_1006: TP14.1 U10.48(LTC_BUSYN)
TP_1007: TP15.1 U11.48(LTC_BUSYN)
TP_1008: TP16.1 U12.48(LTC_BUSYN)
TP_1009: TP36.1 U18.48(LTC_BUSYN)
TP_10010: TP37.1 U19.48(LTC_BUSYN)
TP_10011: TP38.1 U20.48(LTC_BUSYN)
TP_10012: TP39.1 U21.48(LTC_BUSYN)
TP_10013: TP44.1 U24.48(LTC_BUSYN)
TP_10014: TP45.1 U25.48(LTC_BUSYN)
TP_10015: TP46.1 U26.48(LTC_BUSYN)
TP_10016: TP47.1 U27.48(LTC_BUSYN)
TX_BTC_0: R7.1 U4.24(RPT_P) U5.24(RPT_P) U6.24(RPT_P) U7.24(RPT_P) U8.61(AN25/PWM1H/PMD1/RPI81/RE1) U9.24(RPT_P) U10.24(RPT_P) U11.24(RPT_P) U12.24(RPT_P)
TX_BTC_1: R53.1 U8.1(AN29/PWM3H/PMD5/RP85/RE5) U18.24(RPT_P) U19.24(RPT_P) U20.24(RPT_P) U21.24(RPT_P) U24.24(RPT_P) U25.24(RPT_P) U26.24(RPT_P) U27.24(RPT_P)
TX_LTC_0: R8.2 U4.23(RPT_N) U5.23(RPT_N) U6.23(RPT_N) U7.23(RPT_N) U8.60(AN24/PWM1L/PMD0/RP80/RE0) U9.23(RPT_N) U10.23(RPT_N) U11.23(RPT_N) U12.23(RPT_N)
TX_LTC_1: R54.2 U8.2(AN30/PWM4L/PMD6/RPI86/RE6) U18.23(RPT_N) U19.23(RPT_N) U20.23(RPT_N) U21.23(RPT_N) U24.23(RPT_N) U25.23(RPT_N) U26.23(RPT_N) U27.23(RPT_N)
USB5.0V: D9.4 D9.6 J2.1 R32.1 R33.2
VCAP: C139.1 U8.56(VCAP)
VDD_PLL: C261.1 FB1.2 U4.8(VDDA_PLL) U4.9(VDD_PLL) U5.8(VDDA_PLL) U5.9(VDD_PLL) U6.8(VDDA_PLL) U6.9(VDD_PLL) U7.8(VDDA_PLL) U7.9(VDD_PLL) U9.8(VDDA_PLL) U9.9(VDD_PLL) U10.8(VDDA_PLL) U10.9(VDD_PLL) U11.8(VDDA_PLL) U11.9(VDD_PLL) U12.8(VDDA_PLL) U12.9(VDD_PLL) U18.8(VDDA_PLL) U18.9(VDD_PLL) U19.8(VDDA_PLL) U19.9(VDD_PLL) U20.8(VDDA_PLL) U20.9(VDD_PLL) U21.8(VDDA_PLL) U21.9(VDD_PLL) U24.8(VDDA_PLL) U24.9(VDD_PLL) U25.8(VDDA_PLL) U25.9(VDD_PLL) U26.8(VDDA_PLL) U26.9(VDD_PLL) U27.8(VDDA_PLL) U27.9(VDD_PLL)
XCLK1: R27.2 U8.46(INT0/DMH/RP64/RD0) U8.49(VCPCON/RP65/RD1) U8.52(PMWR/RP68/RD4) U8.53(PMRD/RP69/RD5)
XCLKIN: R27.1 R30.1 U4.11(XCLKIN)
XCLKOUT_1: U4.12(XCLKOUT) U5.11(XCLKIN)
XCLKOUT_2: U5.12(XCLKOUT) U6.11(XCLKIN)
XCLKOUT_3: U6.12(XCLKOUT) U7.11(XCLKIN)
XCLKOUT_4: U7.12(XCLKOUT) U9.11(XCLKIN)
XCLKOUT_5: U9.12(XCLKOUT) U10.11(XCLKIN)
XCLKOUT_6: U10.12(XCLKOUT) U11.11(XCLKIN)
XCLKOUT_7: U11.12(XCLKOUT) U12.11(XCLKIN)
XCLKOUT_8: U12.12(XCLKOUT) U18.11(XCLKIN)
XCLKOUT_9: U18.12(XCLKOUT) U19.11(XCLKIN)
XCLKOUT_10: U19.12(XCLKOUT) U20.11(XCLKIN)
XCLKOUT_11: U20.12(XCLKOUT) U21.11(XCLKIN)
XCLKOUT_12: U21.12(XCLKOUT) U24.11(XCLKIN)
XCLKOUT_13: U24.12(XCLKOUT) U25.11(XCLKIN)
XCLKOUT_14: U25.12(XCLKOUT) U26.11(XCLKIN)
XCLKOUT_15: U26.12(XCLKOUT) U27.11(XCLKIN)
XCLKOUT_16: TP48.1 U27.12(XCLKOUT)
YELLOW: D6.2(A) U8.44(ASCL1/PMCS2/RPI74/RD10)
NetR50_2: R50.2 R51.1 U22.2(ADJ)
NetR52_2: R52.2 R55.1 U23.2(ADJ)
NetTP9_1: TP9.1 U8.6(C2IN3-/SDO2/PMA3/RP120/RG8)
NetTP10_1: TP10.1 U8.8(C2IN1-/PMA2/RPI121/RG9)
NetTP11_1: TP11.1 U8.54(C3IN2-/RP70/RD6)
NetTP12_1: TP12.1 U8.13(AN3/C2IN1+/VPIO/RPI35/RB3)
NetTP17_1: TP17.1 U8.14(AN2/C2IN2-/VMIO/RPI34/RB2)
NetTP18_1: TP18.1 U8.51(PMBE/RP67/RD3)
NetTP19_1: TP19.1 U8.50(DPH/RP66/RD2)
NetTP20_1: TP20.1 U8.21(AN8/PMA6/RPI40/RB8)
NetTP21_1: TP21.1 U8.22(AN9/PMA7//RPI41/RB9)
NetTP22_1: TP22.1 U8.43(ASDA1/DPLN/RPI73/RD9)
NetTP23_1: TP23.1 U8.42(RTCC/DMLN/RPI72/RD8)
NetTP24_1: TP24.1 U8.24(TDO/AN11/PMA12/RPI43/RB11)
NetTP25_1: TP25.1 U8.27(TCK/AN12/PMA11/RPI44/RB12)
NetTP26_1: TP26.1 U8.28(TDI/AN13/PMA10/RPI45/RB13)
NetTP27_1: TP27.1 U8.29(AN14/PMA1/RPI46/RB14)
NetTP28_1: TP28.1 U8.30(AN15/PMA0/RPI47/RB15)
NetTP29_1: TP29.1 U8.31(SDA2/PMA9/RP100/RF4)
NetTP30_1: TP30.1 U8.32(SCL2/PMA8/RP101/RF5)
NetTP31_1: TP31.1 U8.33(USBID/RP99/RF3)
NetTP53_1: TP53.1 U8.11(AN5/C1IN1+/VBUSON/VBUSST/RPI37/RB5)
NetTP54_1: TP54.1 U8.12(AN4/C1IN2-/USBOEN/RPI36/RB4)

Not connected (* = marked no-connect by the designer): J2 4*; U14 4(N.C.)*; U15 2(NC)* 3(NC)* 4(NC)*; U22 3(NC)* 4(NC)*; U23 3(NC)* 4(NC)*

## Notes on the sheet
- PD: GC3355 UART mode
- 0
- (near U4) 0
- (near U5) 1
- 1
- (near U6) 0
- (near U7) 1
- (near U9) 0
- (near U10) 1
- (near U11) 0
- (near U22) BD00KA5WF-E2
- (near FB1) BLM21PG331SN1D-Farenll
- (near R50) 10k=1V_output
- 6.04k=0.9001V_output
- (near R51) 0603SAF0303T50
- (near U18) 0
- (near U19) 1
- (near U20) 0
- (near U21) 1
- (near U23) BD00KA5WF-E2
- (near R55) 0603SAF0303T50
- (near U26) 0
- (near U27) 1
- (in symbol CON000000048) gnd

## Library data of the parts
C1-C3 C69 C139 C191 C226 C275 = CAP000043636: DB_PART_TYPE: Ceramic_SMD\Standard_X5R; DB_MANUFACTURER_PART: KEMET    C0805C106K4PAC; NOTE: <NOTE>; DB_T_RANGE: -55 to 85; DB_PACKAGE: 0805; DB_DESCRIPTION: C X5R 10uF 10% 16V 0805; DB_CERTIFIED: ISHIDDEN=T; DB_STATUS: NEW; DB_PART_NUMBER: CAP000043636; DB_PCB_DEVICE: SMD_0805_CAPC2012X145N; DB_PRICE: ISHIDDEN=T; DB_LEADTIME: ISHIDDEN=T; DB_MOQ: ISHIDDEN=T; DB_PRICE_DATE: ISHIDDEN=T; DB_APPROVED_BY: ISHIDDEN=T; DB_APPROVED_ON: 09.10.2010; DB_DATASHEET: http://john.epiqdesign.com/projects/CIS_Datasheets/F3102_CE_Kemet.pdf?rev=92&sc=0
C4-C6 = CAP000028589: DB_PART_TYPE: Ceramic_SMD\Standard_X7R; DB_MANUFACTURER_PART: KEMET    C0805C105J4RAC; NOTE: <NOTE>; DB_T_RANGE: -55 to 125; DB_PACKAGE: 0805; DB_DESCRIPTION: C X7R 1uF 5% 16V 0805; DB_CERTIFIED: ISHIDDEN=T; DB_STATUS: NEW; DB_PART_NUMBER: CAP000028589; DB_PCB_DEVICE: SMD_0805_CAPC2012X145N; DB_PRICE: ISHIDDEN=T; DB_LEADTIME: ISHIDDEN=T; DB_MOQ: ISHIDDEN=T; DB_PRICE_DATE: ISHIDDEN=T; DB_APPROVED_BY: ISHIDDEN=T; DB_APPROVED_ON: 09.10.2010; DB_DATASHEET: http://john.epiqdesign.com/projects/CIS_Datasheets/F3102_CE_Kemet.pdf?rev=92&sc=0
C7-C9 = CAP000027193: DB_PART_TYPE: Ceramic_SMD\Standard_X7R; DB_MANUFACTURER_PART: KEMET    C0805C104K5RAC; NOTE: <NOTE>; DB_T_RANGE: -55 to 125; DB_PACKAGE: 0805; DB_DESCRIPTION: C X7R 100nF 10% 50V 0805; DB_CERTIFIED: ISHIDDEN=T; DB_STATUS: NEW; DB_PART_NUMBER: CAP000027193; DB_PCB_DEVICE: SMD_0805_CAPC2012X145N; DB_PRICE: ISHIDDEN=T; DB_LEADTIME: ISHIDDEN=T; DB_MOQ: ISHIDDEN=T; DB_PRICE_DATE: ISHIDDEN=T; DB_APPROVED_BY: ISHIDDEN=T; DB_APPROVED_ON: 09.10.2010; DB_DATASHEET: http://john.epiqdesign.com/projects/CIS_Datasheets/F3102_CE_Kemet.pdf?rev=92&sc=0
C10 C11 C15 C16 C20 C21 = CAP000043701: DB_PART_TYPE: Ceramic_SMD\Standard_X5R; DB_MANUFACTURER_PART: KEMET    C1210C107M9PAC; NOTE: <NOTE>; DB_T_RANGE: -55 to 85; DB_PACKAGE: 1210; DB_DESCRIPTION: C X5R 100uF 20% 6.3V 1210; DB_CERTIFIED: ISHIDDEN=T; DB_STATUS: NEW; DB_PART_NUMBER: CAP000043701; DB_PCB_DEVICE: SMD_1210_CAPC3225X270N; DB_PRICE: ISHIDDEN=T; DB_LEADTIME: ISHIDDEN=T; DB_MOQ: ISHIDDEN=T; DB_PRICE_DATE: ISHIDDEN=T; DB_APPROVED_BY: ISHIDDEN=T; DB_APPROVED_ON: 09.10.2010; DB_DATASHEET: http://john.epiqdesign.com/projects/CIS_Datasheets/F3102_CE_Kemet.pdf?rev=92&sc=0
C12-C14 C17-C19 C22-C24 C224 C_1-C_6 C_8-C_30 C_33-C_72 = CAP000047355: DB_PART_TYPE: Ceramic_SMD\Standard_X5R; DB_MANUFACTURER_PART: SAMSUNG    CL32A227MQVNNNE; NOTE: <NOTE>; DB_T_RANGE: -55 to 85; DB_PACKAGE: 1210; DB_DESCRIPTION: C X5R 220uF 20% 6.3V 1210; DB_CERTIFIED: ISHIDDEN=T; DB_APPROVED_BY: VSN; DB_STATUS: NEW; DB_PART_NUMBER: CAP000047355; DB_PCB_DEVICE: SMD_1210_CAPC3225X279N; DB_APPROVED_ON: 07.05.2014 11:28:08; DB_DATASHEET: http://john.epiqdesign.com/projects/CIS_Datasheets/CAP_CL32A227MQVNNNE.pdf?rev=1401&sc=0
C25-C68 C70-C85 C118-C137 C140-C163 C175-C190 C227-C258 C262-C273 C276-C291 C324-C383 = CAP000028169: DB_PART_TYPE: Ceramic_SMD\Standard_X7R; DB_MANUFACTURER_PART: KEMET    C0603C474J4RAC; NOTE: <NOTE>; DB_T_RANGE: -55 to 125; DB_PACKAGE: 0603; DB_DESCRIPTION: C X7R 470nF 5% 16V 0603; DB_CERTIFIED: ISHIDDEN=T; DB_STATUS: NEW; DB_PART_NUMBER: CAP000028169; DB_PCB_DEVICE: SMD_0603_CAPC1608X95N; DB_PRICE: ISHIDDEN=T; DB_LEADTIME: ISHIDDEN=T; DB_MOQ: ISHIDDEN=T; DB_PRICE_DATE: ISHIDDEN=T; DB_APPROVED_BY: ISHIDDEN=T; DB_APPROVED_ON: 09.10.2010; DB_DATASHEET: http://john.epiqdesign.com/projects/CIS_Datasheets/F3102_CE_Kemet.pdf?rev=92&sc=0
C138 C166 = CAP000024113: DB_PART_TYPE: Ceramic_SMD\Standard_X7R; DB_MANUFACTURER_PART: KEMET    C0603C102J3RAC; NOTE: <NOTE>; DB_T_RANGE: -55 to 125; DB_PACKAGE: 0603; DB_DESCRIPTION: C X7R 1nF 5% 25V 0603; DB_CERTIFIED: ISHIDDEN=T; DB_STATUS: NEW; DB_PART_NUMBER: CAP000024113; DB_PCB_DEVICE: SMD_0603_CAPC1608X95N; DB_PRICE: ISHIDDEN=T; DB_LEADTIME: ISHIDDEN=T; DB_MOQ: ISHIDDEN=T; DB_PRICE_DATE: ISHIDDEN=T; DB_APPROVED_BY: ISHIDDEN=T; DB_APPROVED_ON: 09.10.2010; DB_DATASHEET: http://john.epiqdesign.com/projects/CIS_Datasheets/F3102_CE_Kemet.pdf?rev=92&sc=0
C167-C172 C260 C261 = CAP000027136: DB_PART_TYPE: Ceramic_SMD\Standard_X7R; DB_MANUFACTURER_PART: KEMET    C0603C104J5RAC; NOTE: <NOTE>; DB_T_RANGE: -55 to 125; DB_PACKAGE: 0603; DB_DESCRIPTION: C X7R 100nF 5% 50V 0603; DB_CERTIFIED: ISHIDDEN=T; DB_STATUS: NEW; DB_PART_NUMBER: CAP000027136; DB_PCB_DEVICE: SMD_0603_CAPC1608X95N; DB_PRICE: ISHIDDEN=T; DB_LEADTIME: ISHIDDEN=T; DB_MOQ: ISHIDDEN=T; DB_PRICE_DATE: ISHIDDEN=T; DB_APPROVED_BY: ISHIDDEN=T; DB_APPROVED_ON: 09.10.2010; DB_DATASHEET: http://john.epiqdesign.com/projects/CIS_Datasheets/F3102_CE_Kemet.pdf?rev=92&sc=0
C173 C174 = CAP000031922: DB_PART_TYPE: Ceramic_SMD\Standard_C0G; DB_MANUFACTURER_PART: KEMET    C0603C180J5GAC; NOTE: <NOTE>; DB_T_RANGE: -55 to 125; DB_PACKAGE: 0603; DB_DESCRIPTION: C C0G 18pF 5% 50V 0603; DB_CERTIFIED: ISHIDDEN=T; DB_STATUS: NEW; DB_PART_NUMBER: CAP000031922; DB_PCB_DEVICE: SMD_0603_CAPC1608X95N; DB_PRICE: ISHIDDEN=T; DB_LEADTIME: ISHIDDEN=T; DB_MOQ: ISHIDDEN=T; DB_PRICE_DATE: ISHIDDEN=T; DB_APPROVED_BY: ISHIDDEN=T; DB_APPROVED_ON: 09.10.2010; DB_DATASHEET: http://john.epiqdesign.com/projects/CIS_Datasheets/F3102_CE_Kemet.pdf?rev=92&sc=0
C225 C259 C274 = CAP000043686: DB_PART_TYPE: Ceramic_SMD\Standard_X5R; DB_MANUFACTURER_PART: KEMET    C0805C226M9PAC; NOTE: <NOTE>; DB_T_RANGE: -55 to 85; DB_PACKAGE: 0805; DB_DESCRIPTION: C X5R 22uF 20% 6.3V 0805; DB_CERTIFIED: ISHIDDEN=T; DB_STATUS: NEW; DB_PART_NUMBER: CAP000043686; DB_PCB_DEVICE: SMD_0805_CAPC2012X145N; DB_PRICE: ISHIDDEN=T; DB_LEADTIME: ISHIDDEN=T; DB_MOQ: ISHIDDEN=T; DB_PRICE_DATE: ISHIDDEN=T; DB_APPROVED_BY: ISHIDDEN=T; DB_APPROVED_ON: 09.10.2010; DB_DATASHEET: http://john.epiqdesign.com/projects/CIS_Datasheets/F3102_CE_Kemet.pdf?rev=92&sc=0
D1-D3 = DDE000000490: DB_PART_TYPE: Schottky; DB_MANUFACTURER_PART: Diodes        BAT54C; NOTE: <NOTE>; DB_T_RANGE: -65 to +150; DB_VOLTAGE: 30V; DB_CURRENT: 200mA; DB_PACKAGE: SOT23; DB_DESCRIPTION: D BAT54C SOT23; DB_CERTIFIED: ISHIDDEN=T; DB_STATUS: NEW; DB_PART_NUMBER: DDE000000490; DB_PCB_DEVICE: SMD_SOT23_SOT95P240X120-3N; DB_PRICE: ISHIDDEN=T; DB_LEADTIME: ISHIDDEN=T; DB_MOQ: ISHIDDEN=T; DB_PRICE_DATE: ISHIDDEN=T; DB_APPROVED_BY: ISHIDDEN=T; DB_APPROVED_ON: 09.10.2010; DB_DATASHEET: ISHIDDEN=T
D4-D7 = LED_2: NOTE: <NOTE>; DB_PCB_DEVICE: SMD_0805_LED2012X100N
D8 D10 D11 = DDE000000580: DB_PART_TYPE: Schottky; DB_MANUFACTURER_PART: Diodes        B140; NOTE: <NOTE>; DB_T_RANGE: -65 to +150; DB_VOLTAGE: 40V; DB_CURRENT: 1A; DB_PACKAGE: SMA; DB_DESCRIPTION: D B140 SMA; DB_CERTIFIED: ISHIDDEN=T; DB_STATUS: NEW; DB_PART_NUMBER: DDE000000580; DB_PCB_DEVICE: SMD_DO214AC_SMA; DB_PRICE: ISHIDDEN=T; DB_LEADTIME: ISHIDDEN=T; DB_MOQ: ISHIDDEN=T; DB_PRICE_DATE: ISHIDDEN=T; DB_APPROVED_BY: ISHIDDEN=T; DB_APPROVED_ON: 09.10.2010; DB_DATASHEET: ISHIDDEN=T
D9 = DDE000002846: DB_PART_TYPE: ESD protection; DB_MANUFACTURER_PART: ON SEMICONDUCTOR        SMS05T1G; DB_T_RANGE: -55 to 150; DB_VOLTAGE: 5V; DB_PACKAGE: SC-74; DB_DESCRIPTION: D SMS05T1G SC-74; DB_CERTIFIED: ISHIDDEN=T; DB_APPROVED_BY: VSN; DB_STATUS: NEW; DB_PART_NUMBER: DDE000002846; DB_PCB_DEVICE: SMD_SOT457_SOT95P275X110-6N; DB_APPROVED_ON: 24.03.2014 10:22:08; DB_DATASHEET: http://john.epiqdesign.com/projects/CIS_Datasheets/IC_SMS05T1-D.pdf?rev=1323&sc=0
D12 = DDE000001725: DB_PART_TYPE: TVS; DB_MANUFACTURER_PART: Diodes        SMCJ12A; NOTE: <NOTE>; DB_T_RANGE: -55 to 150; DB_VOLTAGE: 12V; DB_CURRENT: 75A(Max); DB_PACKAGE: SMC; DB_DESCRIPTION: D SMCJ12A SMC; DB_CERTIFIED: ISHIDDEN=T; DB_STATUS: NEW; DB_PART_NUMBER: DDE000001725; DB_PCB_DEVICE: SMD_DO214AC_SMC; DB_PRICE: ISHIDDEN=T; DB_LEADTIME: ISHIDDEN=T; DB_MOQ: ISHIDDEN=T; DB_PRICE_DATE: ISHIDDEN=T; DB_APPROVED_BY: ISHIDDEN=T; DB_APPROVED_ON: 09.10.2010; DB_DATASHEET: ISHIDDEN=T
FB1 = IND000000029: DB_PART_TYPE: Inductor; DB_MANUFACTURER_PART: MURATA       BLM21PG221SN1D; NOTE: <NOTE>; DB_TOLERANCE: 25%; DB_T_RANGE: -55 to 125; DB_PACKAGE: 0805; DB_DESCRIPTION: INDUC 220 Ohms 25% 0805; DB_CERTIFIED: ISHIDDEN=T; DB_APPROVED_BY: VSN; DB_STATUS: NEW; DB_PART_NUMBER: IND000000029; DB_PCB_DEVICE: SMD_0805_INDC2012X105N; DB_PRICE: ISHIDDEN=T; DB_LEADTIME: ISHIDDEN=T; DB_MOQ: ISHIDDEN=T; DB_PRICE_DATE: ISHIDDEN=T; DB_APPROVED_ON: 30.06.2011 07:59:29; DB_DATASHEET: http://john.epiqdesign.com/projects/CIS_Datasheets/BLM21P_MURATA.pdf?rev=325&sc=0
FID1 FID2 = FID000000001: NOTE: <NOTE>; DB_VALUE: FIDUCIAL 100X200; DB_DIAMETER: 100X200; DB_PACKAGE: ISHIDDEN=T; DB_STATUS: NEW; DB_PART_NUMBER: FID000000001; DB_PART_TYPE: FIDUCIAL; DB_DESCRIPTION: FIDUCIAL 100x200; DB_PCB_DEVICE: FID100X200; DB_MANUFACTURER_PART: ISHIDDEN=T; DB_CERTIFIED: ISHIDDEN=T; DB_PRICE: ISHIDDEN=T; DB_LEADTIME: ISHIDDEN=T; DB_MOQ: ISHIDDEN=T; DB_PRICE_DATE: ISHIDDEN=T; DB_APPROVED_BY: ISHIDDEN=T; DB_APPROVED_ON: 10.09.2010; DB_DATASHEET: ISHIDDEN=T
J1 = CON000000006: DB_PART_TYPE: Connector; DB_MANUFACTURER_PART: W+P        143-12-005-00; NOTE: <NOTE>; DB_PINS_NUMBER: ISHIDDEN=T; DB_T_RANGE: -55 to 125; DB_PACKAGE: PTH; DB_DESCRIPTION: CONN PCB 5P M S 143-12-005-00; DB_APPROVED_BY: VSN; DB_STATUS: NEW; DB_PART_NUMBER: CON000000006; DB_PITCH: ISHIDDEN=T; DB_VOLTAGE: ISHIDDEN=T; DB_CURRENT: ISHIDDEN=T; DB_IP_CLASS: ISHIDDEN=T; DB_PCB_DEVICE: PTH_HDRV05W64P254_1X05; DB_CERTIFIED: ISHIDDEN=T; DB_PRICE: ISHIDDEN=T; DB_LEADTIME: ISHIDDEN=T; DB_MOQ: ISHIDDEN=T; DB_PRICE_DATE: ISHIDDEN=T; DB_APPROVED_ON: 14.12.2010 10:22:07; DB_DATASHEET: http://john.epiqdesign.com/projects/CIS_Datasheets/143-12-005-00_W+P.pdf?rev=3&sc=0
J2 = CON000000048: DB_PART_TYPE: Connector; DB_MANUFACTURER_PART: CVILUX       CU04-SCM15B0-R0-LF; NOTE: <NOTE>; DB_PINS_NUMBER: 5; DB_PITCH: 0.8; DB_PACKAGE: SMD; DB_DESCRIPTION: CONN  PCB  5P  F  A  USB5 MINI SMD; DB_CERTIFIED: ISHIDDEN=T; DB_APPROVED_BY: VSN; DB_STATUS: NEW; DB_PART_NUMBER: CON000000048; DB_PCB_DEVICE: SMD_CON-CVILUX-CU04-SCM15B0; DB_PRICE: ISHIDDEN=T; DB_LEADTIME: ISHIDDEN=T; DB_MOQ: ISHIDDEN=T; DB_PRICE_DATE: ISHIDDEN=T; DB_APPROVED_ON: 02.05.2011 10:29:38; DB_DATASHEET: http://john.epiqdesign.com/projects/CIS_Datasheets/USB%20MINI_CVILUX.pdf?rev=249&sc=0
J3 = CON000000272: DB_PART_TYPE: Connector; DB_MANUFACTURER_PART: HOW DER      HD-351-3P; DB_PINS_NUMBER: 3; DB_PITCH: 3.5mm; DB_VOLTAGE: 300VAC; DB_CURRENT: 10A; DB_PACKAGE: PTH; DB_DESCRIPTION: CONN PCB 3P; DB_CERTIFIED: ISHIDDEN=T; DB_APPROVED_BY: VSN; DB_STATUS: NEW; DB_PART_NUMBER: CON000000272; DB_PCB_DEVICE: PTH_CON_HD-351-3P; DB_APPROVED_ON: 07.05.2014 14:06:04; DB_DATASHEET: http://john.epiqdesign.com/projects/CIS_Datasheets/CON_hd-351.pdf?rev=1413&sc=0
J4 = CON000000271: DB_PART_TYPE: Connector; DB_MANUFACTURER_PART: WE         649 006 295 22; DB_PINS_NUMBER: 6; DB_PITCH: 4.2mm; DB_T_RANGE: -40 to 105; DB_VOLTAGE: 600VAC; DB_CURRENT: 6 - 9A; DB_PACKAGE: PTH; DB_DESCRIPTION: CONN PCB 6P M A PTH; DB_CERTIFIED: ISHIDDEN=T; DB_APPROVED_BY: VSN; DB_STATUS: NEW; DB_PART_NUMBER: CON000000271; DB_PCB_DEVICE: PTH_CON_WR-MRC4-6P; DB_APPROVED_ON: 07.05.2014 13:56:56; DB_DATASHEET: http://john.epiqdesign.com/projects/CIS_Datasheets/CON_WR-MPC4.pdf?rev=1412&sc=0
J5-J15 = MTH000000030: DB_PART_TYPE: Mounting Hole; NOTE: <NOTE>; DB_DIAMETER: 4mm; DB_PLATED: Yes; DB_DESCRIPTION: Mounting Hole PTH_MTG400_700; DB_CERTIFIED: ISHIDDEN=T; DB_APPROVED_BY: VSN; DB_STATUS: NEW; DB_PART_NUMBER: MTH000000030; DB_VALUE: PTH_MTG400_700; DB_PCB_DEVICE: PTH_MTG400_700; DB_PRICE: ISHIDDEN=T; DB_LEADTIME: ISHIDDEN=T; DB_MOQ: ISHIDDEN=T; DB_PRICE_DATE: ISHIDDEN=T; DB_APPROVED_ON: 02.04.2013 15:54:43
L1-L3 = L: DB_PCB_DEVICE: SMT_INDM135130X800N
Q1-Q9 = TRA000001604: DB_PART_TYPE: MOSFET\N_Channel; DB_MANUFACTURER_PART: ADVANCED POWER ELECTRONICS CORP      AP1RA03GMT-HF-3; NOTE: <NOTE>; DB_T_RANGE: -55 to 150; DB_VOLTAGE: 30V; DB_CURRENT: 185A; DB_PACKAGE: PQFN 5x6B; DB_DESCRIPTION: TRANS AP1RA03GMT-HF-3 PQFN 5x6B; DB_CERTIFIED: ISHIDDEN=T; DB_APPROVED_BY: VSN; DB_STATUS: NEW; DB_PART_NUMBER: TRA000001604; DB_PCB_DEVICE: SMD_SOIC127P600X110-9AN; DB_APPROVED_ON: 07.05.2014 12:55:44; DB_DATASHEET: http://john.epiqdesign.com/projects/CIS_Datasheets/MOS_AP1RA03GMT-3.pdf?rev=1404&sc=0
R1-R8 R17-R24 R26 R31 R32 R43-R46 R50 R52-R54 R64-R67 = RES000008663: DB_PART_TYPE: SMD; DB_MANUFACTURER_PART: YAGEO    RC0603FR-0710KL; NOTE: <NOTE>; DB_T_RANGE: -55 to 155; DB_POWER: 1/10W; DB_PACKAGE: 0603; DB_DESCRIPTION: R SMD 10k 1% 1/10W 0603; DB_CERTIFIED: ISHIDDEN=T; DB_APPROVED_BY: VSN; DB_STATUS: NEW; R_BDS: R; DB_PART_NUMBER: RES000008663; DB_PCB_DEVICE: SMD_0603_RESC1608X55N; DB_PRICE: ISHIDDEN=T; DB_LEADTIME: ISHIDDEN=T; DB_MOQ: ISHIDDEN=T; DB_PRICE_DATE: ISHIDDEN=T; DB_APPROVED_ON: 08.08.2011 08:31:51; DB_DATASHEET: http://john.epiqdesign.com/projects/CIS_Datasheets/PYu-RC0603_51_RoHS_L_4_YAGEO.pdf?rev=138&sc=0
R25 = RES000006261: DB_PART_TYPE: SMD; DB_MANUFACTURER_PART: YAGEO    RC0603FR-072K4; NOTE: <NOTE>; DB_T_RANGE: -55 to 155; DB_POWER: 1/10W; DB_PACKAGE: 0603; DB_DESCRIPTION: R SMD 2K4 1% 1/10W 0603; DB_CERTIFIED: ISHIDDEN=T; DB_PRICE: 0.00063; DB_MOQ: 5000; DB_STATUS: NEW; R_BDS: R; DB_PART_NUMBER: RES000006261; DB_PCB_DEVICE: SMD_0603_RESC1608X55N; DB_PRICE_DATE: 2010-12-23; DB_APPROVED_BY: ISHIDDEN=T; DB_APPROVED_ON: 09.10.2010; DB_DATASHEET: http://john.epiqdesign.com/projects/CIS_Datasheets/PYu-RC0603_51_RoHS_L_4_YAGEO.pdf?rev=138&sc=0
R27 R30 = RES000006220: DB_PART_TYPE: SMD; DB_MANUFACTURER_PART: YAGEO    RC0603FR-0747R; NOTE: <NOTE>; DB_T_RANGE: -55 to 155; DB_POWER: 1/10W; DB_PACKAGE: 0603; DB_DESCRIPTION: R SMD 47R 1% 1/10W 0603; DB_CERTIFIED: ISHIDDEN=T; DB_PRICE: 0.00063; DB_MOQ: 5000; DB_STATUS: NEW; R_BDS: R; DB_PART_NUMBER: RES000006220; DB_PCB_DEVICE: SMD_0603_RESC1608X55N; DB_PRICE_DATE: 2010-12-23; DB_APPROVED_BY: ISHIDDEN=T; DB_APPROVED_ON: 09.10.2010; DB_DATASHEET: http://john.epiqdesign.com/projects/CIS_Datasheets/PYu-RC0603_51_RoHS_L_4_YAGEO.pdf?rev=138&sc=0
R33 = RES000008926: DB_PART_TYPE: SMD; DB_MANUFACTURER_PART: YAGEO    AC0603FR-070RL; NOTE: <NOTE>; DB_T_RANGE: -55 to 155; DB_POWER: 1/10W; DB_PACKAGE: 0603; DB_DESCRIPTION: R SMD 0R 1% 1/10W 0603; DB_CERTIFIED: AUT; DB_APPROVED_BY: VSN; DB_STATUS: NEW; R_BDS: R; DB_PART_NUMBER: RES000008926; DB_PCB_DEVICE: SMD_0603_RESC1608X55N; DB_APPROVED_ON: 21.05.2013 09:19:53; DB_DATASHEET: http://john.epiqdesign.com/projects/CIS_Datasheets/RES_AC_YAGEO.pdf?rev=263&sc=0
R42 = RES000007051: DB_PART_TYPE: SMD; DB_MANUFACTURER_PART: YAGEO    RC1206JR-072R; NOTE: <NOTE>; DB_T_RANGE: -55 to 155; DB_POWER: 1/4W; DB_PACKAGE: 1206; DB_DESCRIPTION: R SMD 2R 5% 1/4W 1206; DB_CERTIFIED: ISHIDDEN=T; DB_STATUS: NEW; R_BDS: R; DB_PART_NUMBER: RES000007051; DB_PCB_DEVICE: SMD_1206_RESC3216X65N; DB_PRICE: ISHIDDEN=T; DB_LEADTIME: ISHIDDEN=T; DB_MOQ: ISHIDDEN=T; DB_PRICE_DATE: ISHIDDEN=T; DB_APPROVED_BY: ISHIDDEN=T; DB_APPROVED_ON: 09.10.2010; DB_DATASHEET: http://john.epiqdesign.com/projects/CIS_Datasheets/PYu-RC1206_51_RoHS_L_4_YAGEO.pdf?rev=138&sc=0
R47 = RES000006922: DB_PART_TYPE: SMD; DB_MANUFACTURER_PART: YAGEO    RC1206FR-07100R; NOTE: <NOTE>; DB_T_RANGE: -55 to 155; DB_POWER: 1/4W; DB_PACKAGE: 1206; DB_DESCRIPTION: R SMD 100R 1% 1/4W 1206; DB_CERTIFIED: ISHIDDEN=T; DB_STATUS: NEW; R_BDS: R; DB_PART_NUMBER: RES000006922; DB_PCB_DEVICE: SMD_1206_RESC3216X65N; DB_PRICE: ISHIDDEN=T; DB_LEADTIME: ISHIDDEN=T; DB_MOQ: ISHIDDEN=T; DB_PRICE_DATE: ISHIDDEN=T; DB_APPROVED_BY: ISHIDDEN=T; DB_APPROVED_ON: 09.10.2010; DB_DATASHEET: http://john.epiqdesign.com/projects/CIS_Datasheets/PYu-RC1206_51_RoHS_L_4_YAGEO.pdf?rev=138&sc=0
R48 R49 = RES000008756: DB_PART_TYPE: SMD; DB_MANUFACTURER_PART: YAGEO    AC1206FR-070RL; NOTE: <NOTE>; DB_T_RANGE: -55 to 155; DB_POWER: 1/4W; DB_PACKAGE: 1206; DB_DESCRIPTION: R SMD 0R 1% 1/4W 1206; DB_CERTIFIED: AUT; DB_PRICE: ISHIDDEN=T; DB_APPROVED_BY: VSN; DB_STATUS: NEW; R_BDS: R; DB_PART_NUMBER: RES000008756; DB_PCB_DEVICE: SMD_1206_RESC3216X65N; DB_LEADTIME: ISHIDDEN=T; DB_MOQ: ISHIDDEN=T; DB_PRICE_DATE: ISHIDDEN=T; DB_APPROVED_ON: 27.04.2012 12:25:00; DB_DATASHEET: http://john.epiqdesign.com/projects/CIS_Datasheets/RES_AC_YAGEO.pdf?rev=263&sc=0
R51 R55 = RES000006287: DB_PART_TYPE: SMD; DB_MANUFACTURER_PART: YAGEO    RC0603FR-0730K; NOTE: <NOTE>; DB_T_RANGE: -55 to 155; DB_POWER: 1/10W; DB_PACKAGE: 0603; DB_DESCRIPTION: R SMD 30K 1% 1/10W 0603; DB_CERTIFIED: ISHIDDEN=T; DB_PRICE: 0.00063; DB_MOQ: 5000; DB_STATUS: NEW; R_BDS: R; DB_PART_NUMBER: RES000006287; DB_PCB_DEVICE: SMD_0603_RESC1608X55N; DB_PRICE_DATE: 2010-12-23; DB_APPROVED_BY: ISHIDDEN=T; DB_APPROVED_ON: 09.10.2010; DB_DATASHEET: http://john.epiqdesign.com/projects/CIS_Datasheets/PYu-RC0603_51_RoHS_L_4_YAGEO.pdf?rev=138&sc=0
TP1-TP54 = TPO000000001: DB_PART_TYPE: Test Point; DB_VALUE: 100_254; DB_PACKAGE: ISHIDDEN=T; DB_DESCRIPTION: Test Point 100_254; DB_STATUS: NEW; DB_PART_NUMBER: TPO000000001; DB_DIAMETER: 100_254; DB_PCB_DEVICE: SMD_TP_100-254; DB_MANUFACTURER_PART: ISHIDDEN=T; DB_CERTIFIED: ISHIDDEN=T; DB_PRICE: ISHIDDEN=T; DB_LEADTIME: ISHIDDEN=T; DB_MOQ: ISHIDDEN=T; DB_PRICE_DATE: ISHIDDEN=T; DB_APPROVED_BY: ISHIDDEN=T; DB_APPROVED_ON: 10.09.2010; DB_DATASHEET: ISHIDDEN=T
U1-U3 = DRV000000079: DB_PART_TYPE: Power Driver; DB_MANUFACTURER_PART: LINEAR       LTC4449EDCB#TRPBF; DB_T_RANGE: -40 to 125; DB_PACKAGE: DFN-8 (2mmX3mm); DB_DESCRIPTION: IC  LTC4449EDCB#TRPBF   DFN-8 (2mmX3mm); DB_CERTIFIED: ISHIDDEN=T; DB_APPROVED_BY: VSN; DB_STATUS: NEW; DB_PART_NUMBER: DRV000000079; DB_PCB_DEVICE: SMD_SON45P300X200X80-9N; DB_APPROVED_ON: 07.05.2014 13:09:30; DB_DATASHEET: http://john.epiqdesign.com/projects/CIS_Datasheets/IC_LTC4449.pdf?rev=1406&sc=0
U4-U7 U9-U12 U18-U21 U24-U27 = GC3355Q64: GridSeed; DB_PCB_DEVICE: SMT_QFN40P800X800X90-65N
U8 = MCU000000070: DB_PART_TYPE: DSP; DB_MANUFACTURER_PART: MICROCHIP        DSPIC33EP256MU806-E/PT; OriginalSymbolOrigin: (30000,20000); < Value >: Type; DeviceNumbering: Alpha; DeviceDesignator: A; DevicesInPackage: 1; IsHeterogeneous: False; DB_T_RANGE: -40 to 125; DB_PACKAGE: TQFP-64; DB_DESCRIPTION: IC dsPIC33EP256MU806 TQFP-64; DB_CERTIFIED: AUT; DB_PRICE: ISHIDDEN=T; DB_APPROVED_BY: VSN; DB_STATUS: NEW; Package: <Package>; DevicesInView: 1; PackageName: PIC24FJ16GA004_X_PT; DB_PART_NUMBER: MCU000000070; DB_PCB_DEVICE: SMD_QFP50P1200X1200X120-64N; DB_LEADTIME: ISHIDDEN=T; DB_MOQ: ISHIDDEN=T; DB_PRICE_DATE: ISHIDDEN=T; DB_APPROVED_ON: 17.07.2012 14:21:28; DB_DATASHEET: http://john.epiqdesign.com/projects/CIS_Datasheets/dsPIC33EPxxx-Microchip.pdf?rev=798&sc=0
U13 = PSU000000125: DB_PART_TYPE: Linear Voltage Regulator; DB_MANUFACTURER_PART: DIODES        AP78L05SG-13; DB_T_RANGE: -40 to 125; DB_VOLTAGE: 5V; DB_CURRENT: 100mA; DB_PACKAGE: SOIC-8; DB_DESCRIPTION: IC AP78L05SG-13 SOIC-8; DB_CERTIFIED: ISHIDDEN=T; DB_APPROVED_BY: VSN; DB_STATUS: NEW; DB_PART_NUMBER: PSU000000125; DB_PCB_DEVICE: SMD_SOIC127P600X175-8N; DB_APPROVED_ON: 07.05.2014 12:58:07; DB_DATASHEET: http://john.epiqdesign.com/projects/CIS_Datasheets/IC_AP78LXX.pdf?rev=1405&sc=0
U14 = PSU000000126: DB_PART_TYPE: Linear Voltage Regulator; DB_MANUFACTURER_PART: ROHM     BU33TD3WG-TR; DB_T_RANGE: -40 to 85; DB_VOLTAGE: 3.3V; DB_CURRENT: 200mA; DB_DROP_VOLTAGE: 220mV; DB_PACKAGE: SOT23-5; DB_DESCRIPTION: IC BU33TD3WG-TR SOT23-5; DB_CERTIFIED: ISHIDDEN=T; DB_APPROVED_BY: VSN; DB_STATUS: NEW; DB_PART_NUMBER: PSU000000126; DB_PCB_DEVICE: SMD_SOT95P280X135-5N; DB_APPROVED_ON: 07.05.2014 13:14:31; DB_DATASHEET: http://john.epiqdesign.com/projects/CIS_Datasheets/IC_BUXXTD3WG-TR.pdf?rev=1407&sc=0
U15 = PSU000000127: DB_PART_TYPE: Linear Voltage Regulator; DB_MANUFACTURER_PART: ROHM        BD33KA5WF-E2; DB_T_RANGE: -40 to 105; DB_VOLTAGE: 3.3V; DB_CURRENT: 500mA; DB_PACKAGE: SOIC-8; DB_DESCRIPTION: IC BD33KA5WF-E2 SOIC-8; DB_CERTIFIED: ISHIDDEN=T; DB_APPROVED_BY: VSN; DB_STATUS: NEW; DB_PART_NUMBER: PSU000000127; DB_PCB_DEVICE: SMD_SOIC127P620X160-8N; DB_APPROVED_ON: 07.05.2014 13:18:28; DB_DATASHEET: http://john.epiqdesign.com/projects/CIS_Datasheets/IC_bdxxka5wf-e-209388.pdf?rev=1408&sc=0
U16 = PSU000000129: DB_PART_TYPE: Linear Voltage Regulator; DB_MANUFACTURER_PART: ST       L7805CD2T-TR; NOTE: <NOTE>; DB_T_RANGE: 0 to 125; DB_VOLTAGE: 5V; DB_CURRENT: 1A; DB_PACKAGE: D2PAK; DB_DESCRIPTION: IC  L7805CD2T-TR  D2PAK; DB_CERTIFIED: ISHIDDEN=T; DB_APPROVED_BY: VSN; DB_STATUS: NEW; DB_PART_NUMBER: PSU000000129; DB_PCB_DEVICE: SMD_TO254P1542X460-3_4N; DB_APPROVED_ON: 07.05.2014 13:29:21; DB_DATASHEET: http://john.epiqdesign.com/projects/CIS_Datasheets/IC_L7805C.pdf?rev=1409&sc=0
U17 = PSU000000031: DB_PART_TYPE: Linear Voltage Regulator; DB_MANUFACTURER_PART: ON Semiconductor       MC78M05BDTRKG; NOTE: <NOTE>; DB_T_RANGE: -40 to 125; DB_VOLTAGE: 5V; DB_CURRENT: 500mA; DB_DROP_VOLTAGE: 2V; DB_PACKAGE: DPAK; DB_DESCRIPTION: IC  MC78M05BDTRKG  DPAK; DB_CERTIFIED: ISHIDDEN=T; DB_APPROVED_BY: VSN; DB_STATUS: NEW; DB_PART_NUMBER: PSU000000031; DB_PCB_DEVICE: SMD_TO229P991X239-4N_DPAK; DB_PRICE: ISHIDDEN=T; DB_LEADTIME: ISHIDDEN=T; DB_MOQ: ISHIDDEN=T; DB_PRICE_DATE: ISHIDDEN=T; DB_APPROVED_ON: 31.03.2011 10:50:15; DB_DATASHEET: http://john.epiqdesign.com/projects/CIS_Datasheets/MC78M00-D_ONSEMI.pdf?rev=192&sc=0
U22 U23 = PSU000000128: DB_PART_TYPE: Linear Voltage Regulator; DB_MANUFACTURER_PART: ROHM        BD00KA5WF-E2; DB_T_RANGE: -40 to 105; DB_VOLTAGE: 3.3V; DB_CURRENT: 500mA; DB_PACKAGE: SOIC-8; DB_DESCRIPTION: IC BD00KA5WF-E2 SOIC-8; DB_CERTIFIED: ISHIDDEN=T; DB_APPROVED_BY: VSN; DB_STATUS: NEW; DB_PART_NUMBER: PSU000000128; DB_PCB_DEVICE: SMD_SOIC127P620X160-8N; DB_APPROVED_ON: 07.05.2014 13:19:57; DB_DATASHEET: http://john.epiqdesign.com/projects/CIS_Datasheets/IC_bdxxka5wf-e-209388.pdf?rev=1408&sc=0
Y1 = OSC000000012: DB_PART_TYPE: Oscillator; DB_MANUFACTURER_PART: IQD       4.00MHz HC49/4HSMX; NOTE: <NOTE>; DB_ACCURACY: 100ppm; DB_T_RANGE: -10 to 60; DB_FREQUENCY: 4MHz; DB_PACKAGE: SMD; DB_DESCRIPTION: IC  4.00MHz HC49/4HSMX  SMD; DB_CERTIFIED: ISHIDDEN=T; DB_APPROVED_BY: VSN; DB_STATUS: NEW; DB_PART_NUMBER: OSC000000012; DB_PCB_DEVICE: SMD_HC49_XTAL1140X480X420N; DB_PRICE: ISHIDDEN=T; DB_LEADTIME: ISHIDDEN=T; DB_MOQ: ISHIDDEN=T; DB_PRICE_DATE: ISHIDDEN=T; DB_APPROVED_ON: 26.04.2012 15:32:29; DB_DATASHEET: http://john.epiqdesign.com/projects/CIS_Datasheets/hc49-4hsmx_IQD_oscillators.pdf?rev=713&sc=0